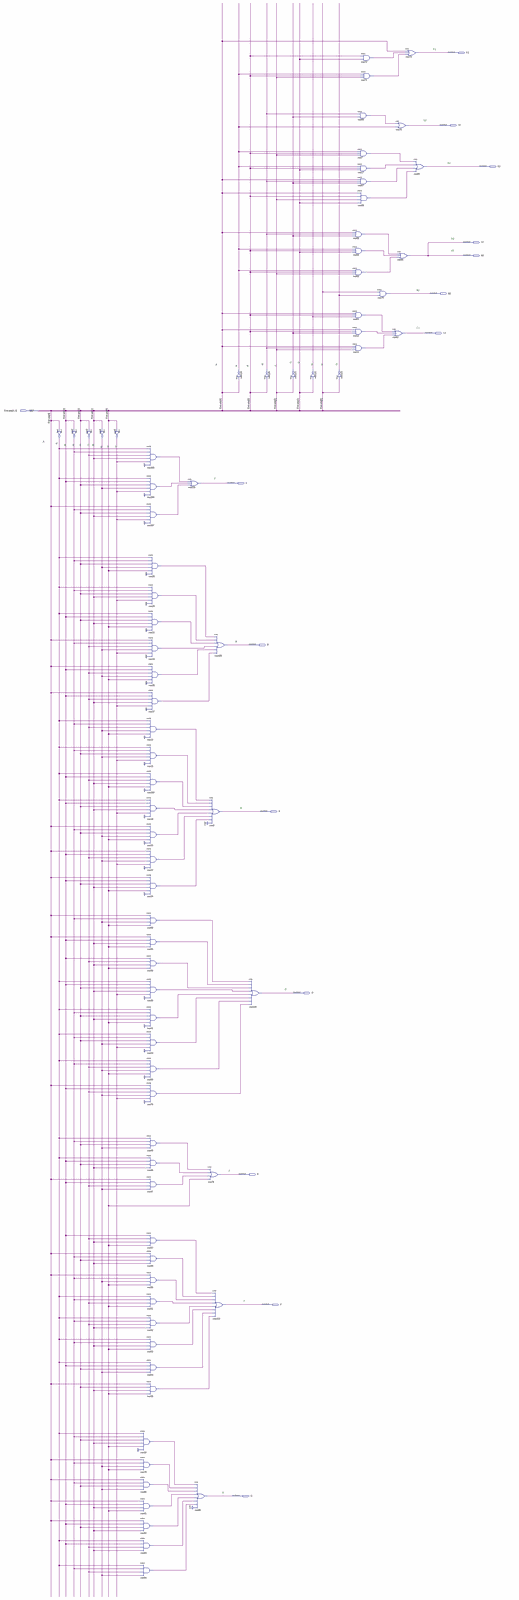
[diagram p0: schematic sheet, whole]
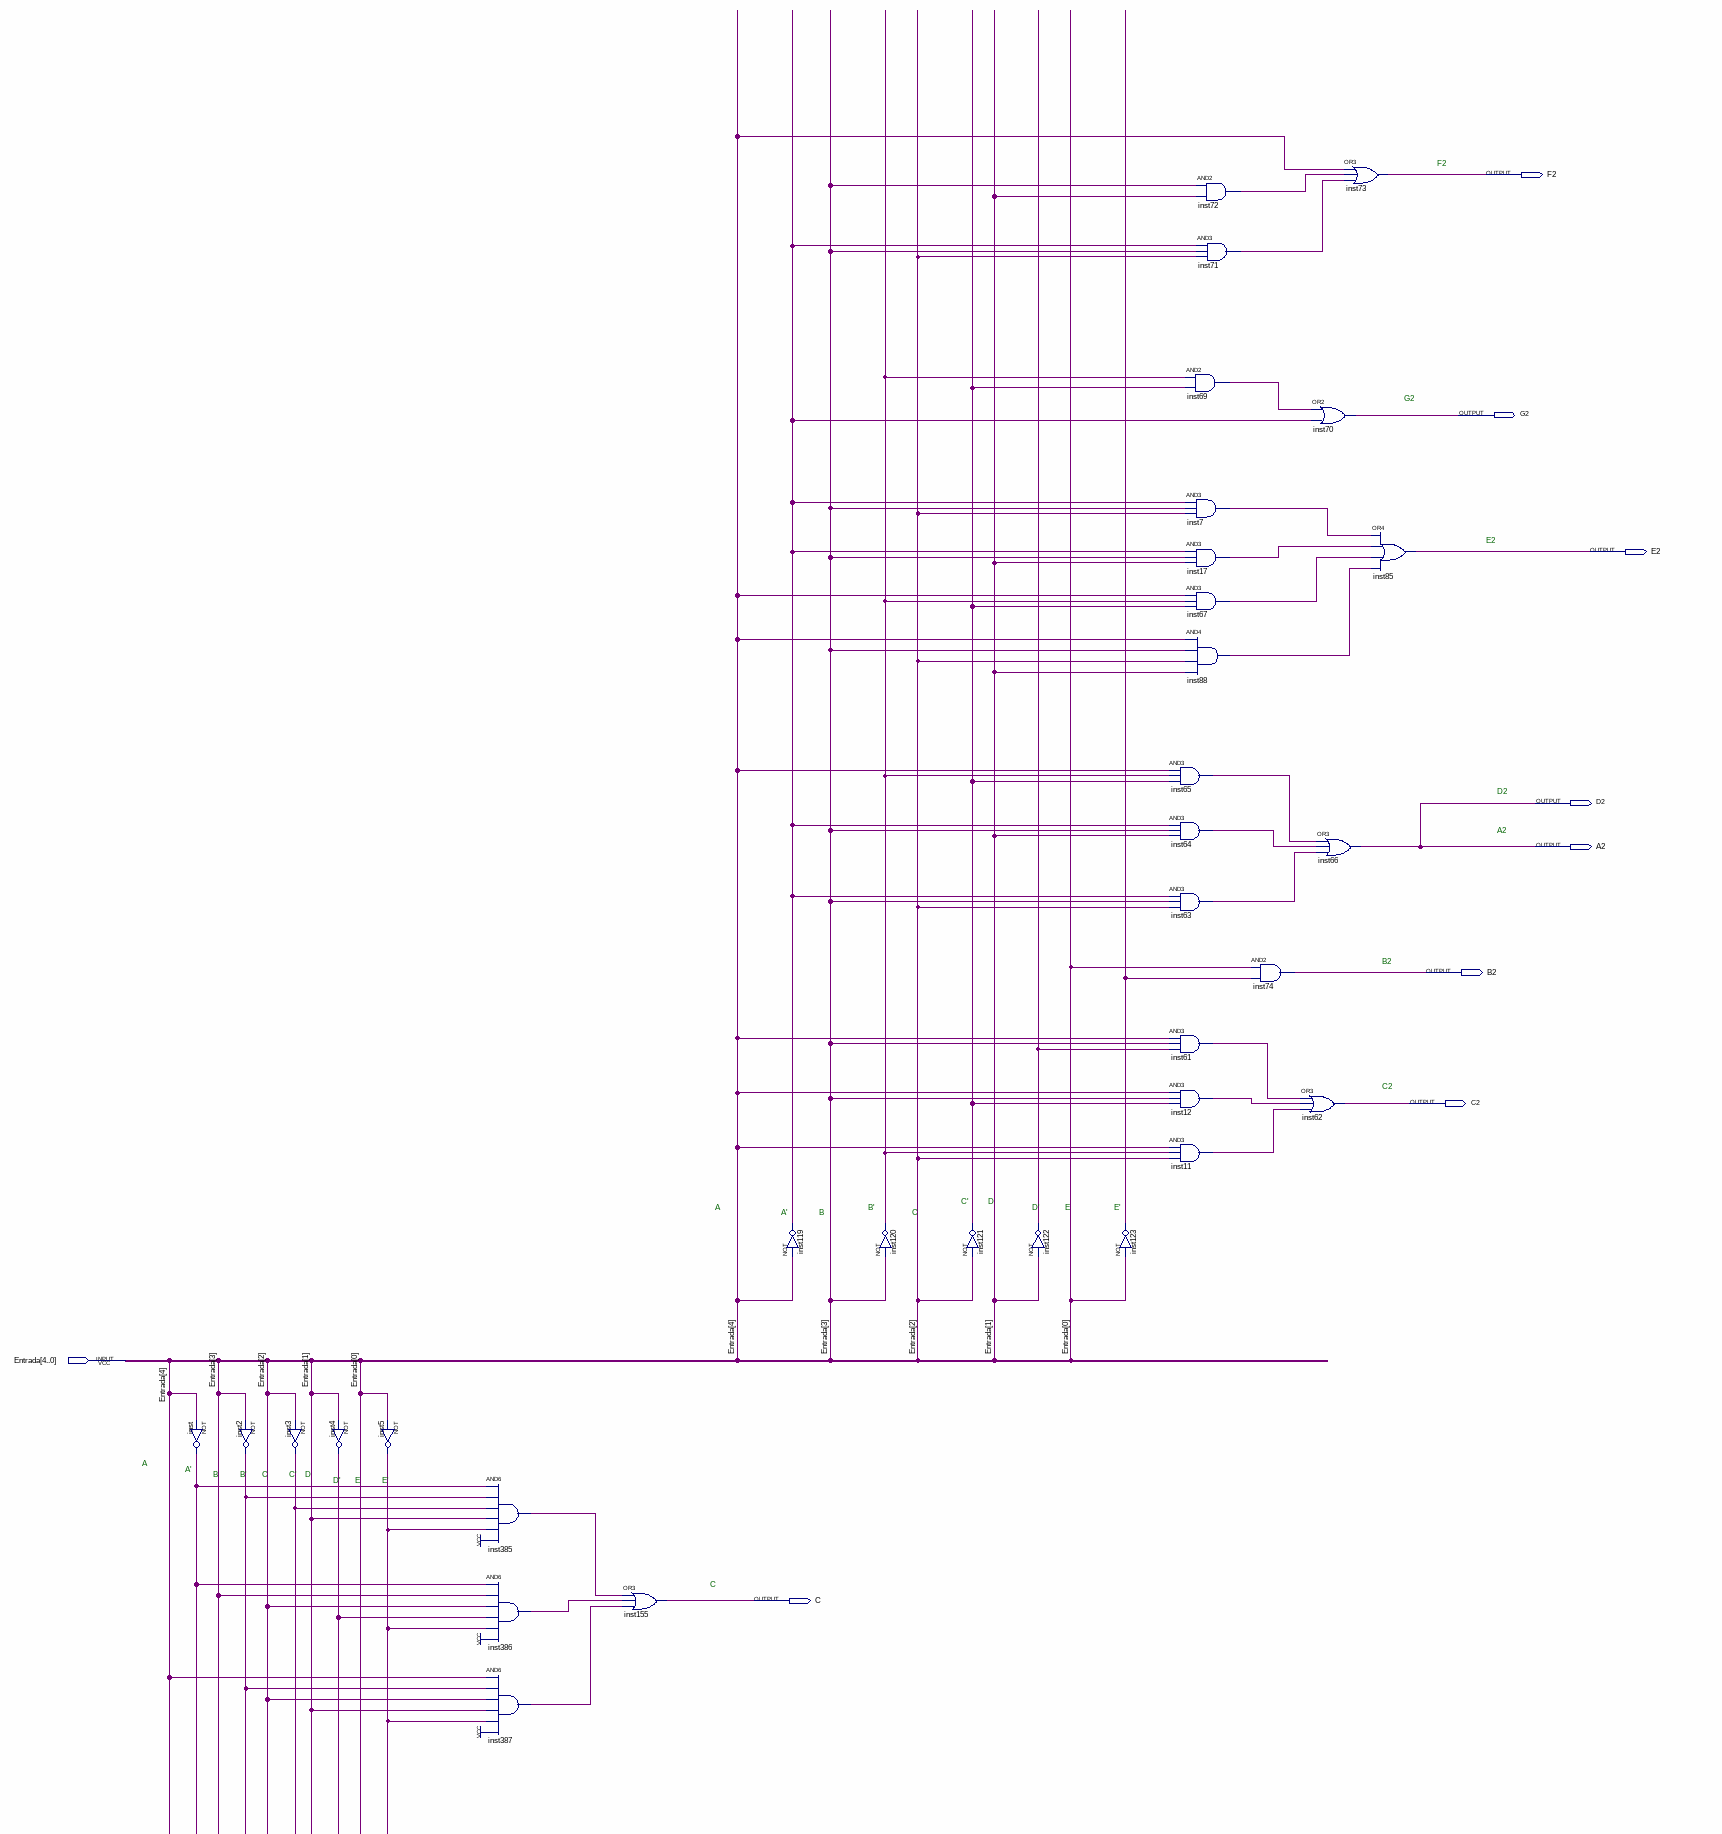
[diagram p1: schematic sheet, upper part]
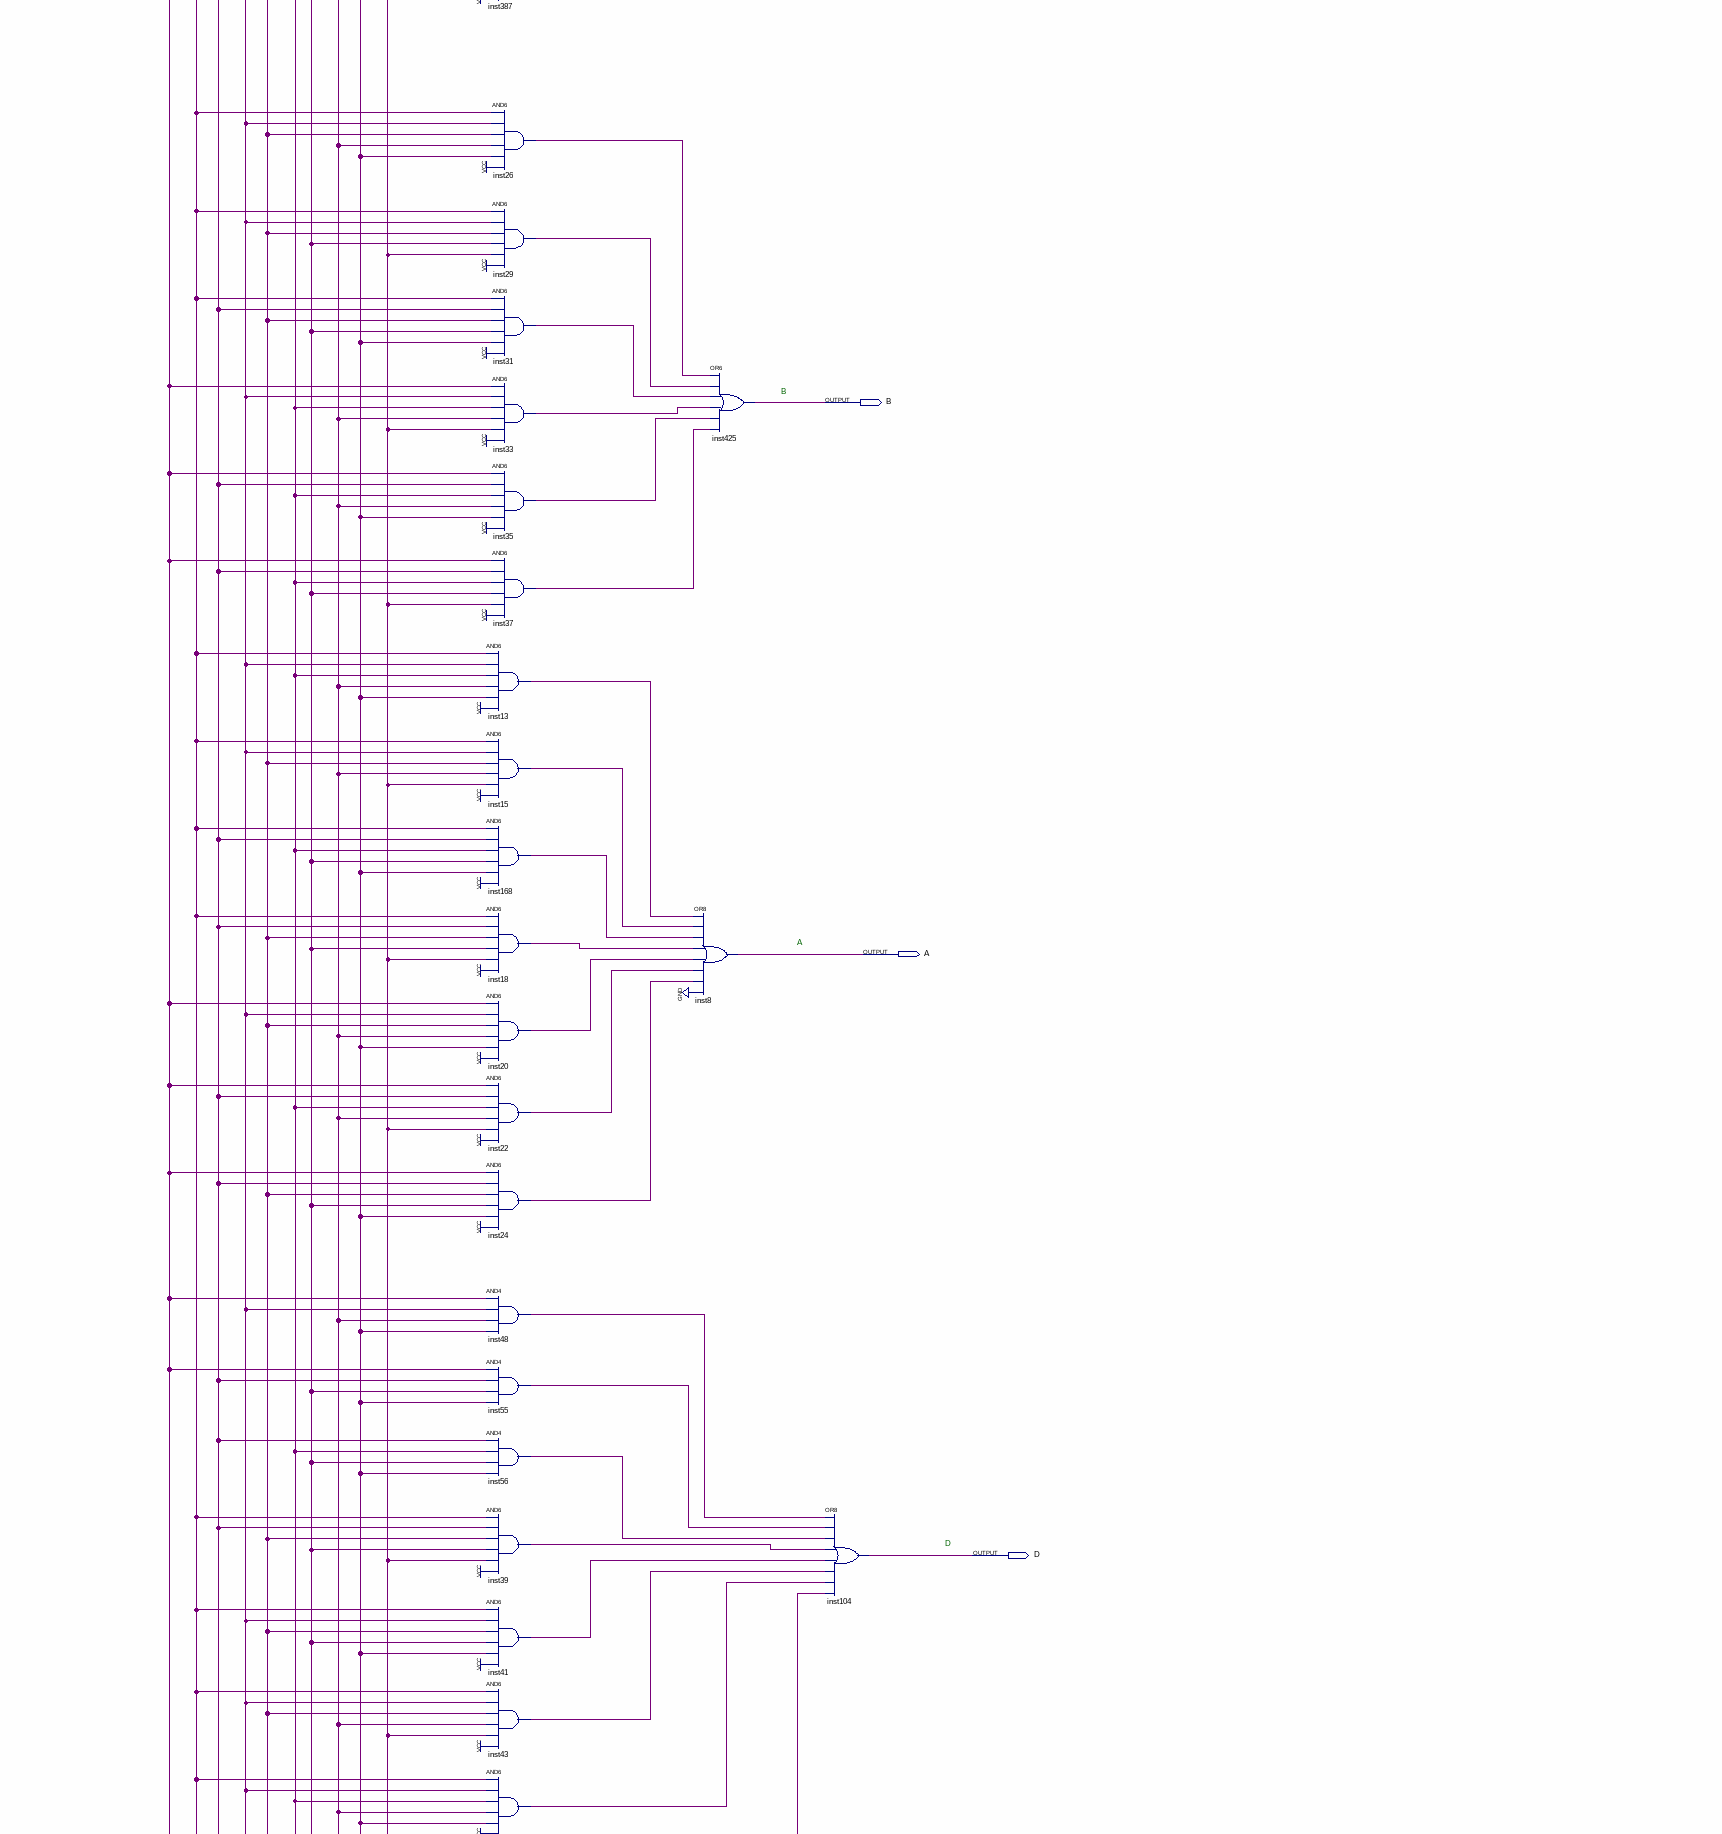
[diagram p2: schematic sheet, middle part]
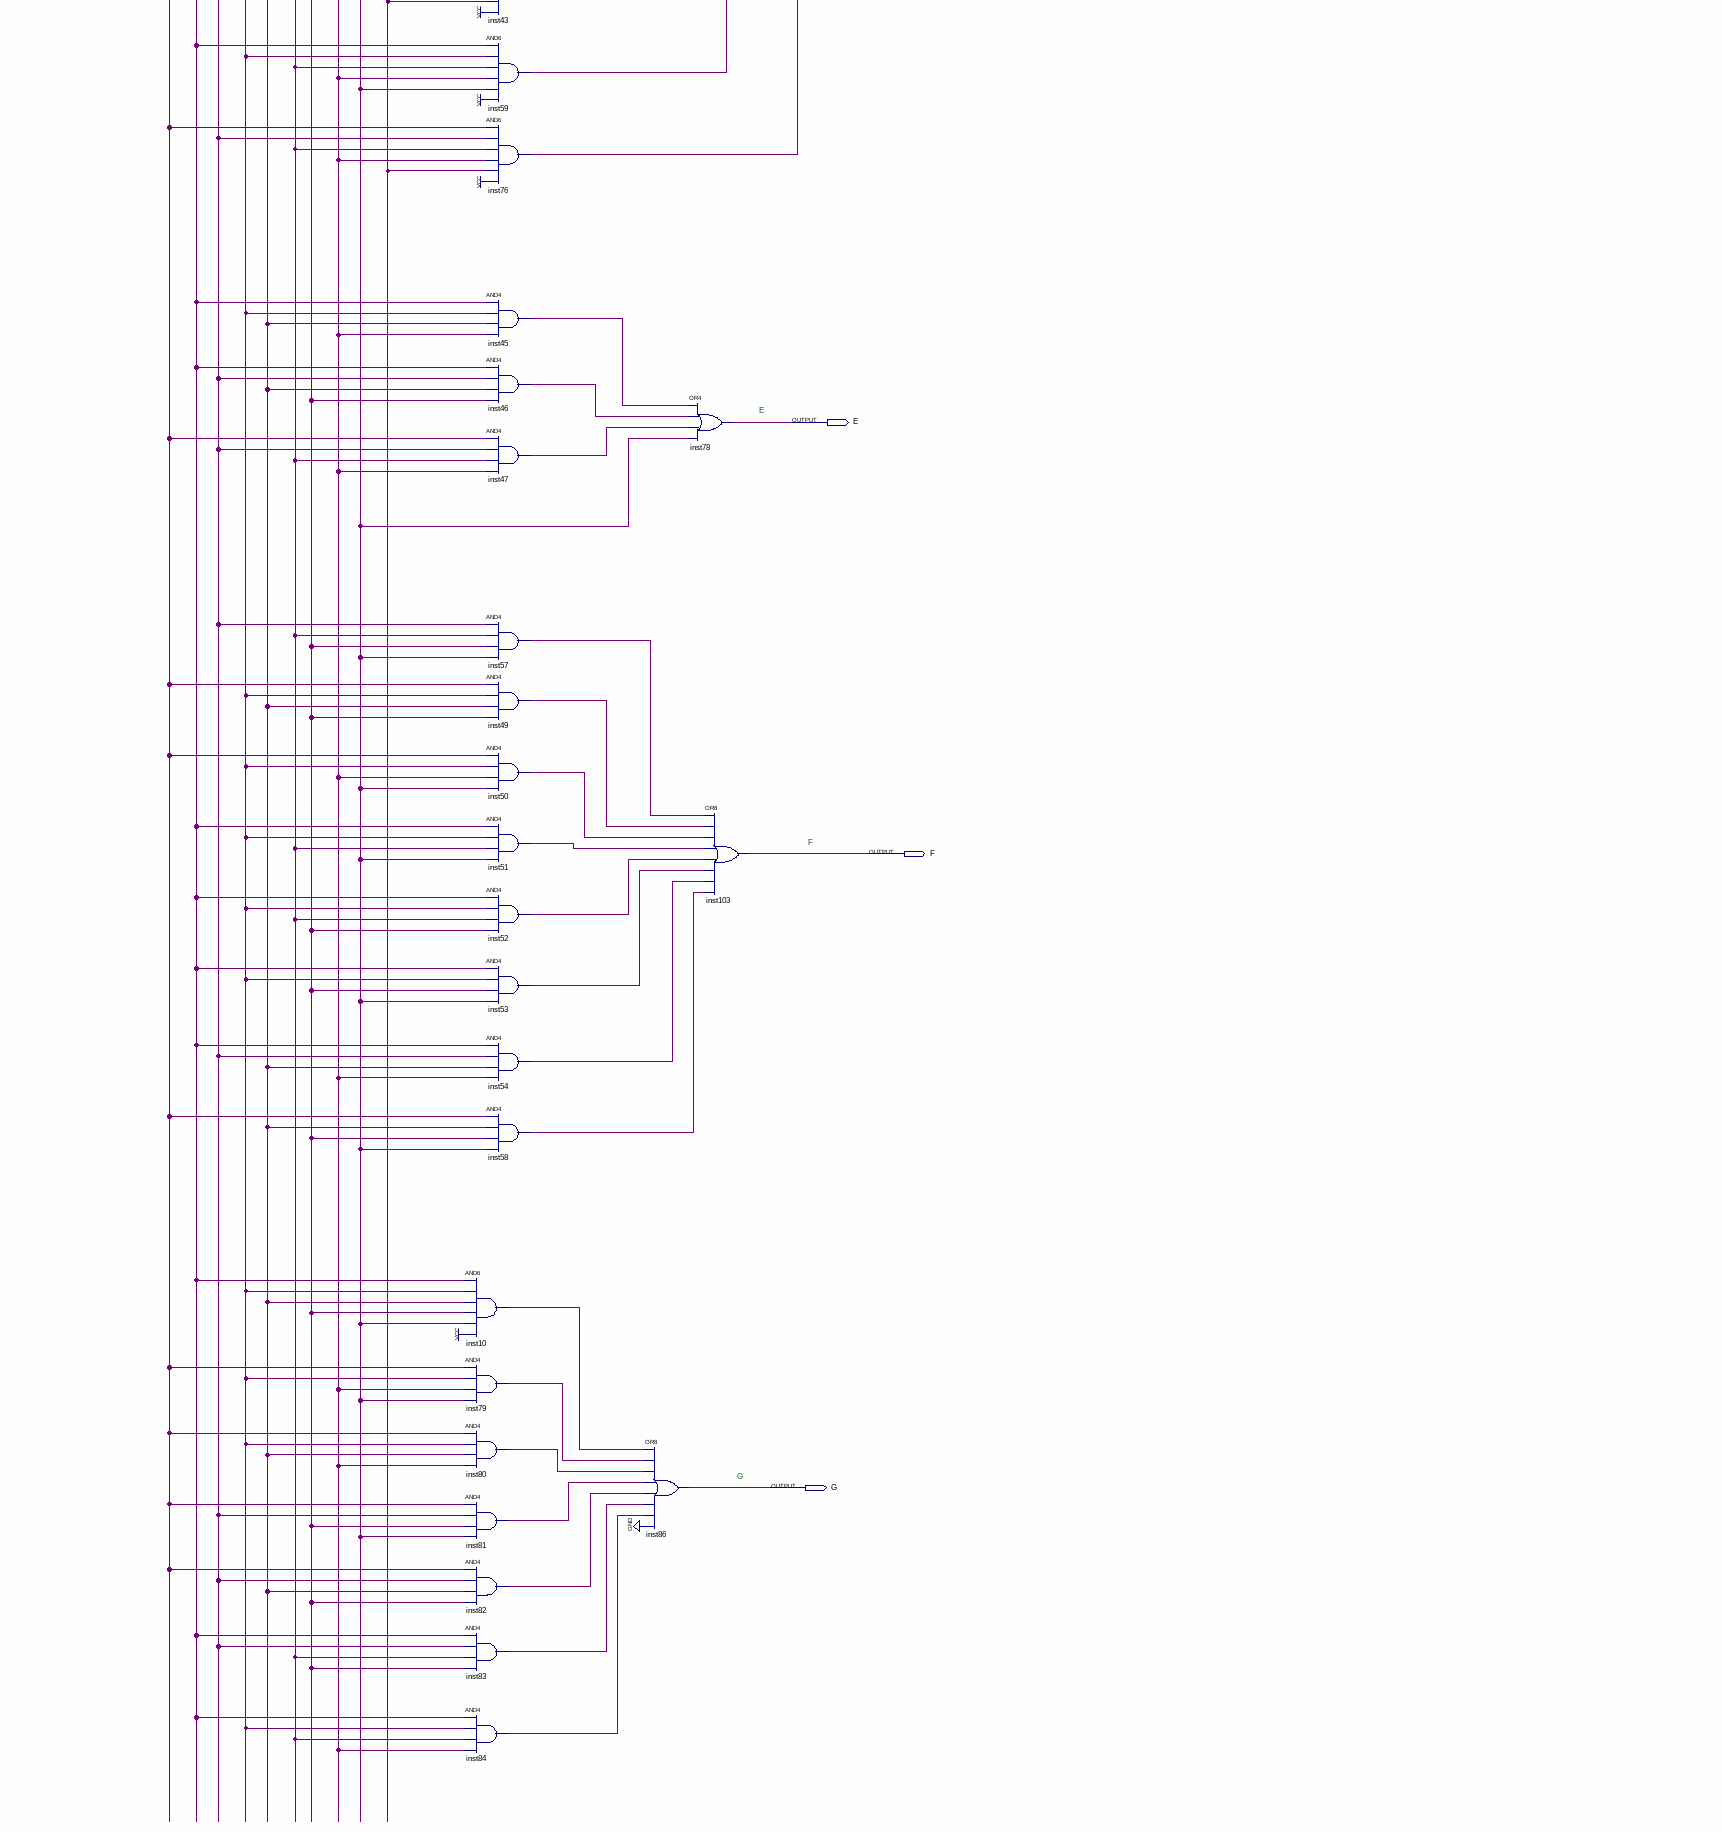
[diagram p3: schematic sheet, lower part]
// Quartus schematic Decoder7_5.bdf as structural Verilog: 78 symbols, 15 pins
module Decoder7_5 (
  input  [4:0] Entrada,
  output F2,
  output G2,
  output E2,
  output D2,
  output A2,
  output B2,
  output C2,
  output C,
  output B,
  output A,
  output D,
  output E,
  output F,
  output G
);

  wire inst2_out, inst3_out, inst4_out, inst5_out, inst7_out, inst10_out, inst11_out, inst12_out, inst13_out,
       inst15_out, inst17_out, inst18_out, inst20_out, inst22_out, inst24_out, inst26_out, inst29_out,
       inst31_out, inst33_out, inst35_out, inst37_out, inst39_out, inst41_out, inst43_out, inst45_out,
       inst46_out, inst47_out, inst48_out, inst49_out, inst50_out, inst51_out, inst52_out, inst53_out,
       inst54_out, inst55_out, inst56_out, inst57_out, inst58_out, inst59_out, inst61_out, inst63_out,
       inst64_out, inst65_out, inst67_out, inst69_out, inst71_out, inst72_out, inst76_out, inst79_out,
       inst80_out, inst81_out, inst82_out, inst83_out, inst84_out, inst88_out, inst119_out, inst120_out,
       inst121_out, inst122_out, inst123_out, inst168_out, inst385_out, inst386_out, inst387_out, inst_out;

  not inst (inst_out, Entrada[4]);
  not inst2 (inst2_out, Entrada[3]);
  not inst3 (inst3_out, Entrada[2]);
  not inst4 (inst4_out, Entrada[1]);
  not inst5 (inst5_out, Entrada[0]);
  and inst10 (inst10_out, inst_out, inst2_out, Entrada[2], Entrada[1], Entrada[0], 1'b1);
  and inst79 (inst79_out, Entrada[4], inst2_out, inst4_out, Entrada[0]);
  and inst80 (inst80_out, Entrada[4], inst2_out, Entrada[2], inst4_out);
  and inst81 (inst81_out, Entrada[4], Entrada[3], Entrada[1], Entrada[0]);
  and inst82 (inst82_out, Entrada[4], Entrada[3], Entrada[2], Entrada[1]);
  and inst83 (inst83_out, inst_out, Entrada[3], inst3_out, Entrada[1]);
  and inst84 (inst84_out, inst_out, inst2_out, inst3_out, inst4_out);
  and inst385 (inst385_out, inst_out, inst2_out, inst3_out, Entrada[1], inst5_out, 1'b1);
  and inst386 (inst386_out, inst_out, Entrada[3], Entrada[2], inst4_out, inst5_out, 1'b1);
  and inst387 (inst387_out, Entrada[4], inst2_out, Entrada[2], Entrada[1], inst5_out, 1'b1);
  and inst26 (inst26_out, inst_out, inst2_out, Entrada[2], inst4_out, Entrada[0], 1'b1);
  and inst29 (inst29_out, inst_out, inst2_out, Entrada[2], Entrada[1], inst5_out, 1'b1);
  and inst31 (inst31_out, inst_out, Entrada[3], Entrada[2], Entrada[1], Entrada[0], 1'b1);
  and inst33 (inst33_out, Entrada[4], inst2_out, inst3_out, inst4_out, inst5_out, 1'b1);
  and inst35 (inst35_out, Entrada[4], Entrada[3], inst3_out, inst4_out, Entrada[0], 1'b1);
  and inst37 (inst37_out, Entrada[4], Entrada[3], inst3_out, Entrada[1], inst5_out, 1'b1);
  and inst13 (inst13_out, inst_out, inst2_out, inst3_out, inst4_out, Entrada[0], 1'b1);
  and inst15 (inst15_out, inst_out, inst2_out, Entrada[2], inst4_out, inst5_out, 1'b1);
  and inst168 (inst168_out, inst_out, Entrada[3], inst3_out, Entrada[1], Entrada[0], 1'b1);
  and inst18 (inst18_out, inst_out, Entrada[3], Entrada[2], Entrada[1], inst5_out, 1'b1);
  and inst20 (inst20_out, Entrada[4], inst2_out, Entrada[2], inst4_out, Entrada[0], 1'b1);
  and inst22 (inst22_out, Entrada[4], Entrada[3], inst3_out, inst4_out, inst5_out, 1'b1);
  and inst24 (inst24_out, Entrada[4], Entrada[3], Entrada[2], Entrada[1], Entrada[0], 1'b1);
  and inst48 (inst48_out, Entrada[4], inst2_out, inst4_out, Entrada[0]);
  and inst55 (inst55_out, Entrada[4], Entrada[3], Entrada[1], Entrada[0]);
  and inst56 (inst56_out, Entrada[3], inst3_out, Entrada[1], Entrada[0]);
  and inst39 (inst39_out, inst_out, Entrada[3], Entrada[2], Entrada[1], inst5_out, 1'b1);
  and inst41 (inst41_out, inst_out, inst2_out, Entrada[2], Entrada[1], Entrada[0], 1'b1);
  and inst43 (inst43_out, inst_out, inst2_out, Entrada[2], inst4_out, inst5_out, 1'b1);
  and inst59 (inst59_out, inst_out, inst2_out, inst3_out, inst4_out, Entrada[0], 1'b1);
  and inst76 (inst76_out, Entrada[4], Entrada[3], inst3_out, inst4_out, inst5_out, 1'b1);
  and inst45 (inst45_out, inst_out, inst2_out, Entrada[2], inst4_out);
  and inst46 (inst46_out, inst_out, Entrada[3], Entrada[2], Entrada[1]);
  and inst47 (inst47_out, Entrada[4], Entrada[3], inst3_out, inst4_out);
  and inst57 (inst57_out, Entrada[3], inst3_out, Entrada[1], Entrada[0]);
  and inst49 (inst49_out, Entrada[4], inst2_out, Entrada[2], Entrada[1]);
  and inst50 (inst50_out, Entrada[4], inst2_out, inst4_out, Entrada[0]);
  and inst51 (inst51_out, inst_out, inst2_out, inst3_out, Entrada[0]);
  and inst52 (inst52_out, inst_out, inst2_out, inst3_out, Entrada[1]);
  and inst53 (inst53_out, inst_out, inst2_out, Entrada[1], Entrada[0]);
  and inst54 (inst54_out, inst_out, Entrada[3], Entrada[2], inst4_out);
  and inst58 (inst58_out, Entrada[4], Entrada[2], Entrada[1], Entrada[0]);
  or inst155 (C, inst385_out, inst386_out, inst387_out);
  or inst86 (G, inst10_out, inst79_out, inst80_out, inst81_out, inst82_out, inst83_out, inst84_out, 1'b0);
  or inst8 (A, inst13_out, inst15_out, inst168_out, inst18_out, inst20_out, inst22_out, inst24_out, 1'b0);
  or inst78 (E, inst45_out, inst46_out, inst47_out, Entrada[0]);
  or inst425 (B, inst26_out, inst29_out, inst31_out, inst33_out, inst35_out, inst37_out);
  or inst103 (F, inst57_out, inst49_out, inst50_out, inst51_out, inst52_out, inst53_out, inst54_out, inst58_out);
  not inst119 (inst119_out, Entrada[4]);
  or inst104 (D, inst48_out, inst55_out, inst56_out, inst39_out, inst41_out, inst43_out, inst59_out, inst76_out);
  not inst120 (inst120_out, Entrada[3]);
  not inst121 (inst121_out, Entrada[2]);
  not inst122 (inst122_out, Entrada[1]);
  not inst123 (inst123_out, Entrada[0]);
  and inst65 (inst65_out, Entrada[4], inst120_out, inst121_out);
  and inst64 (inst64_out, inst119_out, Entrada[3], Entrada[1]);
  and inst63 (inst63_out, inst119_out, Entrada[3], Entrada[2]);
  and inst61 (inst61_out, Entrada[4], Entrada[3], inst122_out);
  and inst12 (inst12_out, Entrada[4], Entrada[3], inst121_out);
  and inst11 (inst11_out, Entrada[4], inst120_out, Entrada[2]);
  and inst72 (inst72_out, Entrada[3], Entrada[1]);
  and inst71 (inst71_out, inst119_out, Entrada[3], Entrada[2]);
  and inst69 (inst69_out, inst120_out, inst121_out);
  and inst7 (inst7_out, inst119_out, Entrada[3], Entrada[2]);
  and inst17 (inst17_out, inst119_out, Entrada[3], Entrada[1]);
  and inst67 (inst67_out, Entrada[4], inst120_out, inst121_out);
  and inst88 (inst88_out, Entrada[4], Entrada[3], Entrada[2], Entrada[1]);
  and inst74 (B2, Entrada[0], inst123_out);
  or inst70 (G2, inst69_out, inst119_out);
  or inst62 (C2, inst61_out, inst12_out, inst11_out);
  or inst73 (F2, Entrada[4], inst72_out, inst71_out);
  or inst66 (A2, inst65_out, inst64_out, inst63_out);
  or inst85 (E2, inst7_out, inst17_out, inst67_out, inst88_out);

  assign D2 = A2;

  // Notes on the sheet:
  //   F2
  //   G2
  //   E2
  //   D2
  //   A2
  //   B2
  //   C2
  //   C'
  //   D
  //   A
  //   B'
  //   D'
  //   E
  //   E'
  //   A'
  //   B
  //   C
  //   A
  //   A'
  //   B
  //   B'
  //   C
  //   C'
  //   D
  //   D'
  //   E
  //   E'
  //   C
  //   B
  //   A
  //   D
  //   E
  //   F
  //   G
endmodule
